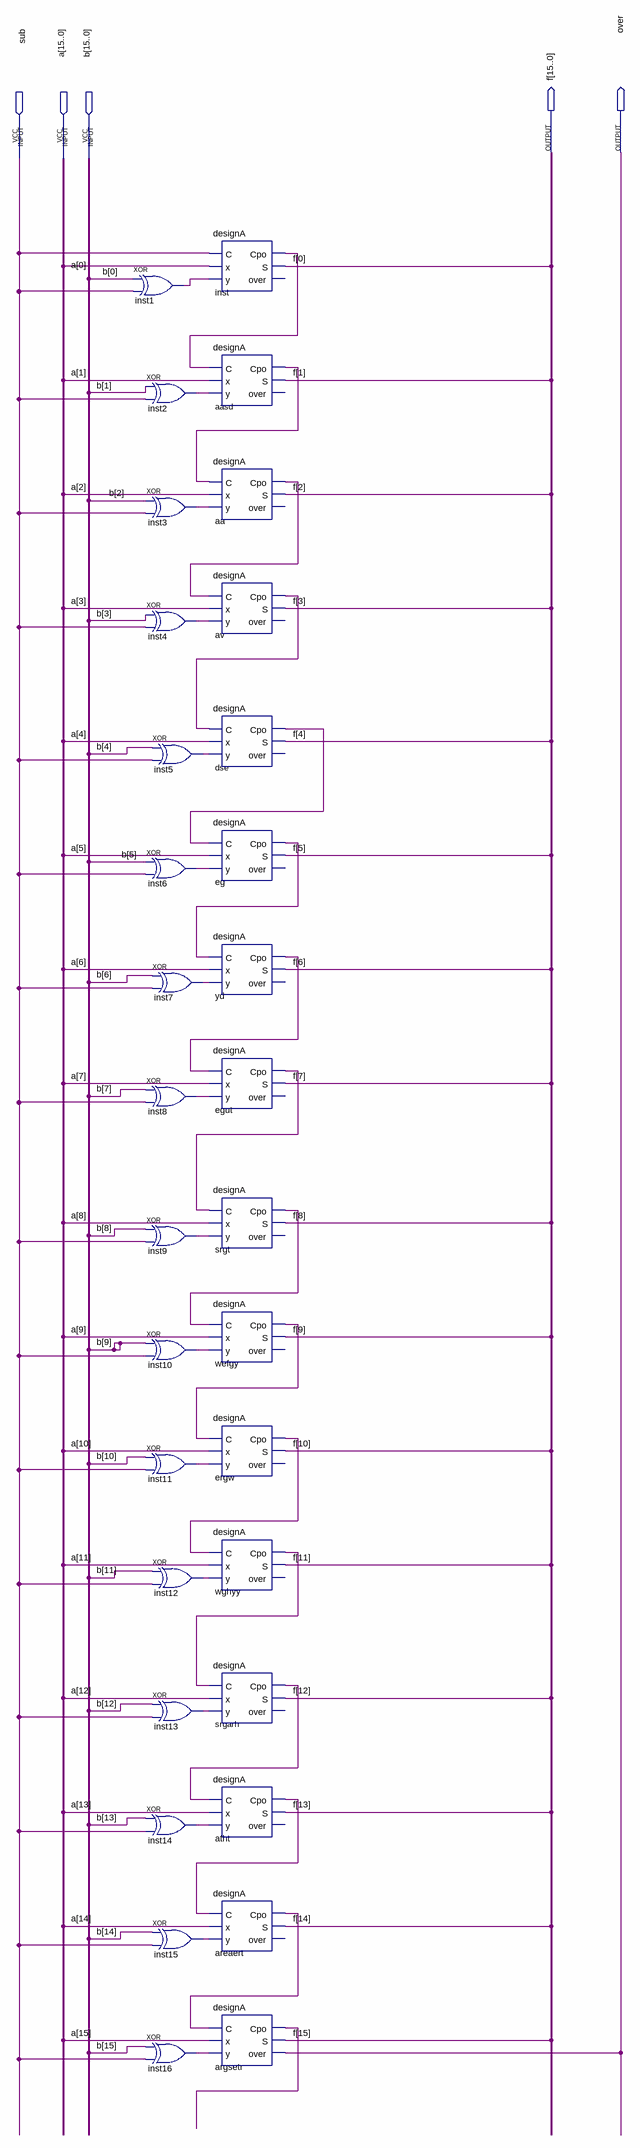
[diagram p0: schematic sheet]
// Quartus schematic adder.bdf as structural Verilog: 32 symbols, 5 pins
module adder (
  input  sub,
  input  [15:0] a,
  input  [15:0] b,
  output [15:0] f,
  output over
);

  wire aa_cpo, aasd_cpo, areaert_cpo, argsetr_cpo, atht_cpo, av_cpo, dse_cpo, eg_cpo, egut_cpo, ergw_cpo,
       inst1_out, inst2_out, inst3_out, inst4_out, inst5_out, inst6_out, inst7_out, inst8_out, inst9_out,
       inst10_out, inst11_out, inst12_out, inst13_out, inst14_out, inst15_out, inst16_out, inst_cpo,
       srgarh_cpo, srgt_cpo, wefgy_cpo, wghyy_cpo, yd_cpo;

  xor inst1 (inst1_out, b[0], sub);
  xor inst2 (inst2_out, b[1], sub);
  xor inst3 (inst3_out, b[2], sub);
  xor inst4 (inst4_out, b[3], sub);
  xor inst5 (inst5_out, b[4], sub);
  xor inst6 (inst6_out, b[5], sub);
  xor inst7 (inst7_out, b[6], sub);
  xor inst8 (inst8_out, b[7], sub);
  xor inst9 (inst9_out, b[8], sub);
  xor inst10 (inst10_out, b[9], sub);
  xor inst11 (inst11_out, b[10], sub);
  xor inst12 (inst12_out, b[11], sub);
  xor inst13 (inst13_out, b[12], sub);
  xor inst14 (inst14_out, b[13], sub);
  xor inst15 (inst15_out, b[14], sub);
  xor inst16 (inst16_out, b[15], sub);
  designA inst (.C(sub), .x(a[0]), .y(inst1_out), .Cpo(inst_cpo), .S(f[0]));  // open: over
  designA aasd (.C(inst_cpo), .x(a[1]), .y(inst2_out), .Cpo(aasd_cpo), .S(f[1]));  // open: over
  designA aa (.C(aasd_cpo), .x(a[2]), .y(inst3_out), .Cpo(aa_cpo), .S(f[2]));  // open: over
  designA av (.C(aa_cpo), .x(a[3]), .y(inst4_out), .Cpo(av_cpo), .S(f[3]));  // open: over
  designA dse (.C(av_cpo), .x(a[4]), .y(inst5_out), .Cpo(dse_cpo), .S(f[4]));  // open: over
  designA eg (.C(dse_cpo), .x(a[5]), .y(inst6_out), .Cpo(eg_cpo), .S(f[5]));  // open: over
  designA yd (.C(eg_cpo), .x(a[6]), .y(inst7_out), .Cpo(yd_cpo), .S(f[6]));  // open: over
  designA egut (.C(yd_cpo), .x(a[7]), .y(inst8_out), .Cpo(egut_cpo), .S(f[7]));  // open: over
  designA srgt (.C(egut_cpo), .x(a[8]), .y(inst9_out), .Cpo(srgt_cpo), .S(f[8]));  // open: over
  designA wefgy (.C(srgt_cpo), .x(a[9]), .y(inst10_out), .Cpo(wefgy_cpo), .S(f[9]));  // open: over
  designA ergw (.C(wefgy_cpo), .x(a[10]), .y(inst11_out), .Cpo(ergw_cpo), .S(f[10]));  // open: over
  designA wghyy (.C(ergw_cpo), .x(a[11]), .y(inst12_out), .Cpo(wghyy_cpo), .S(f[11]));  // open: over
  designA srgarh (.C(wghyy_cpo), .x(a[12]), .y(inst13_out), .Cpo(srgarh_cpo), .S(f[12]));  // open: over
  designA atht (.C(srgarh_cpo), .x(a[13]), .y(inst14_out), .Cpo(atht_cpo), .S(f[13]));  // open: over
  designA areaert (.C(atht_cpo), .x(a[14]), .y(inst15_out), .Cpo(areaert_cpo), .S(f[14]));  // open: over
  designA argsetr (.C(areaert_cpo), .x(a[15]), .y(inst16_out), .Cpo(argsetr_cpo), .S(f[15]), .over(over));
endmodule
